# Altium schematic sheet Module Connector Male.SchDoc: Module Connector Male
size B; SheetNumber: 5; SheetTotal: 14
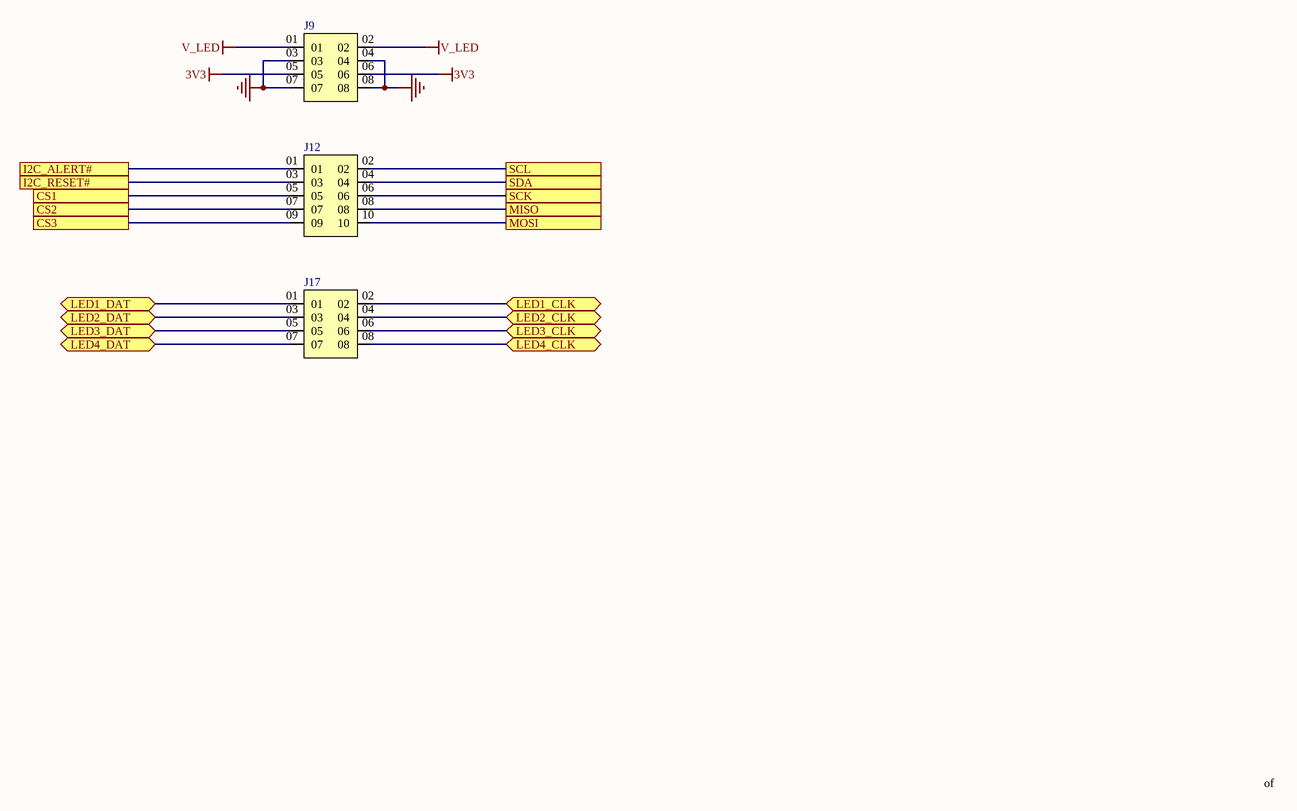
[diagram p0: Module Connector Male.SchDoc]

## Parts
J9  Header 4x2 0.1" RA  [Header 4x2 0.1" RA]  (value not drawn)
J12  Header 5x2 0.1" RA  [Header 5x2 0.1" RA]  (value not drawn)
J17  Header 4x2 0.1" RA  [Header 4x2 0.1" RA]  (value not drawn)

## Ports
CS1, CS2, CS3, I2C_ALERT#, I2C_RESET#, LED1_CLK (bidir), LED1_DAT (bidir), LED2_CLK (bidir), LED2_DAT (bidir), LED3_CLK (bidir), LED3_DAT (bidir), LED4_CLK (bidir), LED4_DAT (bidir), MISO, MOSI, SCK, SCL, SDA

## Nets
3V3: J9.05 J9.06
GND: J9.03 J9.04 J9.07 J9.08
V_LED: J9.01 J9.02
CS1: J12.05 ; port CS1
CS2: J12.07 ; port CS2
CS3: J12.09 ; port CS3
I2C_ALERT#: J12.01 ; port I2C_ALERT#
I2C_RESET#: J12.03 ; port I2C_RESET#
LED1_CLK: J17.02 ; port LED1_CLK
LED1_DAT: J17.01 ; port LED1_DAT
LED2_CLK: J17.04 ; port LED2_CLK
LED2_DAT: J17.03 ; port LED2_DAT
LED3_CLK: J17.06 ; port LED3_CLK
LED3_DAT: J17.05 ; port LED3_DAT
LED4_CLK: J17.08 ; port LED4_CLK
LED4_DAT: J17.07 ; port LED4_DAT
MISO: J12.08 ; port MISO
MOSI: J12.10 ; port MOSI
SCK: J12.06 ; port SCK
SCL: J12.02 ; port SCL
SDA: J12.04 ; port SDA

## Notes on the sheet
- of

## Library data of the parts
J9 J17 = CMP-002-00226-4: Board Connector, 8 Contact(s), 2 Row(s), Female, Right Angle, 0.1 inch Pitch; Gender: Male; Max Current Rating: 3A; Connector Type: BOARD CONNECTOR; RoHS Compliant: Yes; Max Operating Temperature: 105°C; Min Operating Temperature: -40°C; Mounting Technology: Board; Pins: 8
J12 = CMP-002-00230-4: Board Connector, 10 Contact(s), 2 Row(s), Female, Right Angle, 0.1 inch Pitch; Gender: Male; Max Current Rating: 3A; Min Operating Temperature: -40°C; Pins: 10; Mounting Technology: Board; Max Operating Temperature: 125°C; Connector Type: BOARD CONNECTOR; RoHS Compliant: Yes